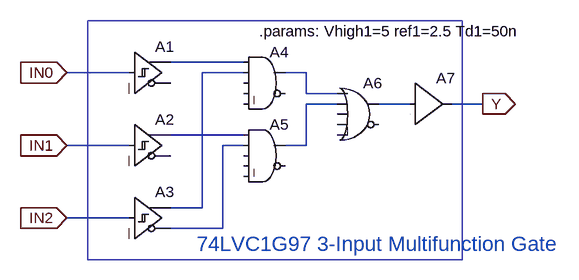
[diagram p0: schematic 74LVC1G97_hierarch_block.asc]
74LVC1G97_hierarch_block.asc, the LTspice schematic file:
Version 4
SHEET 1 880 680
WIRE 320 96 208 96
WIRE 144 112 48 112
WIRE 320 112 256 112
WIRE 416 112 384 112
WIRE 416 144 416 112
WIRE 464 144 416 144
WIRE 464 160 416 160
WIRE 576 160 528 160
WIRE 688 160 640 160
WIRE 320 208 208 208
WIRE 144 224 48 224
WIRE 320 224 288 224
WIRE 416 224 416 160
WIRE 416 224 384 224
WIRE 256 320 256 112
WIRE 256 320 208 320
WIRE 144 336 48 336
WIRE 288 352 288 224
WIRE 288 352 208 352
FLAG 48 112 IN0
IOPIN 48 112 In
FLAG 48 224 IN1
IOPIN 48 224 In
FLAG 48 336 IN2
IOPIN 48 336 In
FLAG 688 160 Y
IOPIN 688 160 Out
SYMBOL Digital\\schmitt 144 48 R0
WINDOW 3 0 0 Invisible 2
SYMATTR Value Td={td1/10} ref={ref1}
SYMATTR InstName A1
SYMATTR Value2 Vhigh={Vhigh1}
SYMBOL Digital\\schmitt 144 160 R0
WINDOW 3 0 0 Invisible 2
SYMATTR Value Td={td1/10} ref={ref1}
SYMATTR InstName A2
SYMATTR Value2 Vhigh={Vhigh1}
SYMBOL Digital\\schmitt 144 272 R0
WINDOW 3 8 36 Invisible 2
SYMATTR Value Td={td1/10} ref={ref1}
SYMATTR InstName A3
SYMATTR Value2 Vhigh={Vhigh1}
SYMBOL Digital\\and 352 64 R0
WINDOW 3 16 44 Invisible 2
SYMATTR Value Vhigh={Vhigh1}
SYMATTR InstName A4
SYMATTR Value2 ref={ref1}
SYMBOL Digital\\and 352 176 R0
WINDOW 3 0 0 Invisible 2
SYMATTR Value Vhigh={Vhigh1}
SYMATTR InstName A5
SYMATTR Value2 ref={ref1}
SYMBOL Digital\\or 496 112 R0
WINDOW 3 0 0 Invisible 2
SYMATTR Value Vhigh={Vhigh1}
SYMATTR InstName A6
SYMATTR Value2 ref={ref1}
SYMBOL Digital\\buf1 576 96 R0
WINDOW 3 0 0 Invisible 2
SYMATTR Value Td={td1/10} ref={ref1}
SYMATTR InstName A7
SYMATTR Value2 Vhigh={Vhigh1}
TEXT 248 376 Left 3 ;74LVC1G97 3-Input Multifunction Gate
TEXT 344 48 Left 2 !.params: Vhigh1=5 ref1=2.5 Td1=50n
RECTANGLE Normal 656 400 80 32

The netlist it stands for:
* 74LVC1G97_hierarch_block.asc
A1 IN0 0 0 0 0 0 N001 0 SCHMITT Td={td1/10} ref={ref1} Vhigh={Vhigh1}
A2 IN1 0 0 0 0 0 N006 0 SCHMITT Td={td1/10} ref={ref1} Vhigh={Vhigh1}
A3 IN2 0 0 0 0 N007 N002 0 SCHMITT Td={td1/10} ref={ref1} Vhigh={Vhigh1}
A4 N001 N002 0 0 0 0 N003 0 AND Vhigh={Vhigh1} ref={ref1}
A5 N006 N007 0 0 0 0 N004 0 AND Vhigh={Vhigh1} ref={ref1}
A6 N003 N004 0 0 0 0 N005 0 OR Vhigh={Vhigh1} ref={ref1}
A7 N005 0 0 0 0 0 Y 0 BUF Td={td1/10} ref={ref1} Vhigh={Vhigh1}
* 74LVC1G97 3-Input Multifunction Gate
.params: Vhigh1=5 ref1=2.5 Td1=50n
.backanno
.end